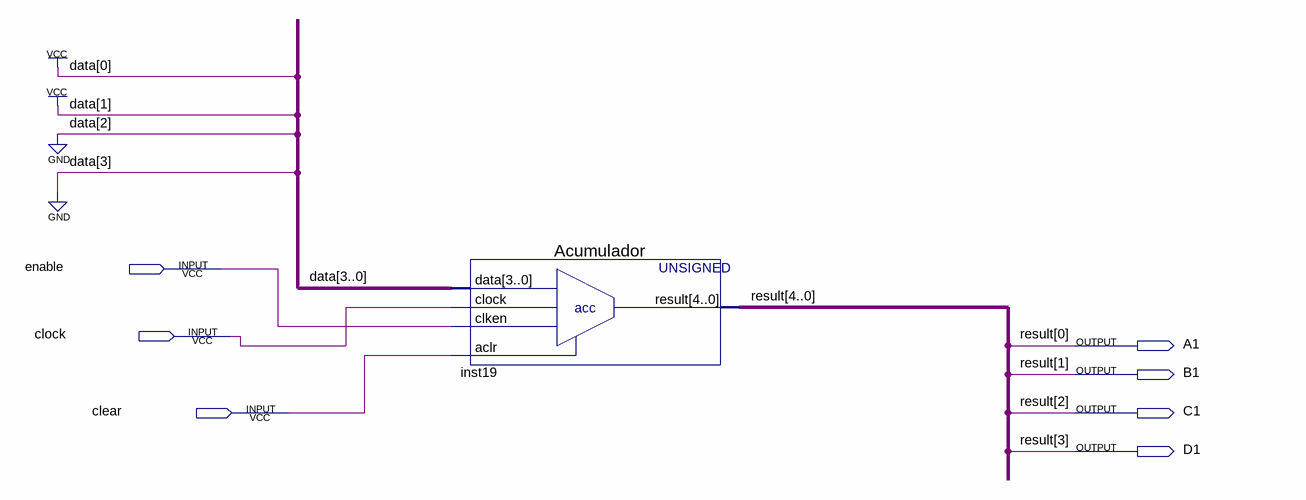
[diagram p0: schematic sheet]
// Quartus schematic BLOCO_ACUMULADOR.bdf as structural Verilog: 1 symbols, 7 pins
module BLOCO_ACUMULADOR (
  input  enable,
  input  clock,
  input  clear,
  output A1,
  output B1,
  output C1,
  output D1
);

  wire [4:4] result;

  Acumulador inst19 (.data(4'b0011), .clock(clock), .clken(enable), .aclr(clear), .result({result[4], D1, C1, B1, A1}));

  // Other names for the same wires on the sheet: result[3:0] = {D1, C1, B1, A1}
endmodule
